# EasyEDA Pro project HACKERCARD.epro

# Schematic Schematic1
Board Name: Board1; Create Date: 2026-04-04; Page Name: P1; Project Name: pcb hacker card; Schematic Name: Schematic1; Update Date: 2026-04-05; Company: EasyEDA.com; Page Size: A4; Version: V1.0
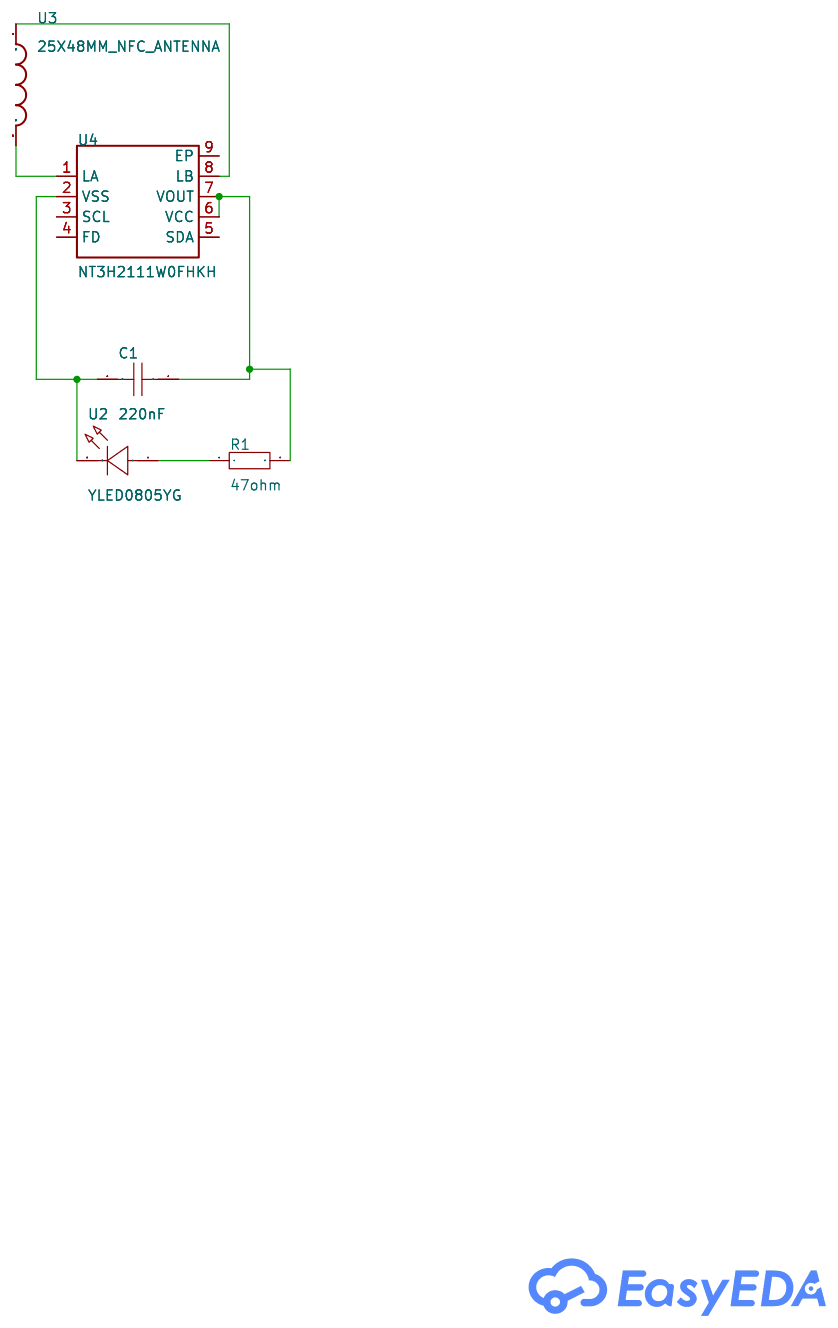
[diagram p0: schematic sheet]

## Parts
C1  220nF  [C0603]
R1  47ohm  [R0603]
U2  YLED0805YG  [LED0805-R-RD]
U3  25X48MM_NFC_ANTENNA  [25X48MM_NFC_ANTENNA]
U4  NT3H2111W0FHKH  [XQFN-8_L1.6-W1.6-P0.50-BL]

## Library data of the parts
C1 = CAP_0603: Supplier Footprint: 0603
R1 = Res_0603: Supplier Footprint: 0603
U2 = YLED0805YG: Lamp Holder Type:- Illumination Color:Yellow Green Voltage - Forward(Vf):1.8V~2.4V Voltage - Forward(Vf):1.8V~2.4V Power(Watts):- Forward Current:30mA Wavelength - Dominant:566nm~576nm Wavelength - Dominant:566nm~576nm Peak Wavelength:- Diode Configuratio; LCSC Part Name: 黄绿色 独立二极管; Supplier Part: C19171393; Manufacturer: YONGYUTAI(永裕泰); Supplier Footprint: 0805; JLCPCB Part Class: Extended Part; Datasheet: https://item.szlcsc.com/datasheet/YLED0805YG/20382444.html; Supplier: LCSC; Illumination Color: Yellow Green; Voltage - Forward(Vf): 1.8V~2.4V; Forward Current: 30mA; Wavelength - Dominant: 566nm~576nm; Diode Configuration: Discrete Diode; Luminous Intensity: 70mcd; Viewing Angle: 120°; Operating Temperature: -40℃~+85℃
U3 = 25X48MM_NFC_ANTENNA
U4 = NT3H2111W0FHKH: Supplier: LCSC; Supplier Part: C710403; Manufacturer: NXP(恩智浦); JLCPCB Part Class: Extended Part

## Nets
$1N359: U3.P$2 U4.1(LA)
$1N364: U3.P$1 U4.8(LB)
$1N689: C1.2 U2.2 U4.2(VSS)
$1N745: C1.1 R1.2 U4.6(VCC) U4.7(VOUT)
$1N815: R1.1 U2.1

Not connected (* = marked no-connect by the designer): U4 3(SCL) 4(FD) 5(SDA) 9(EP)

# Board PCB1
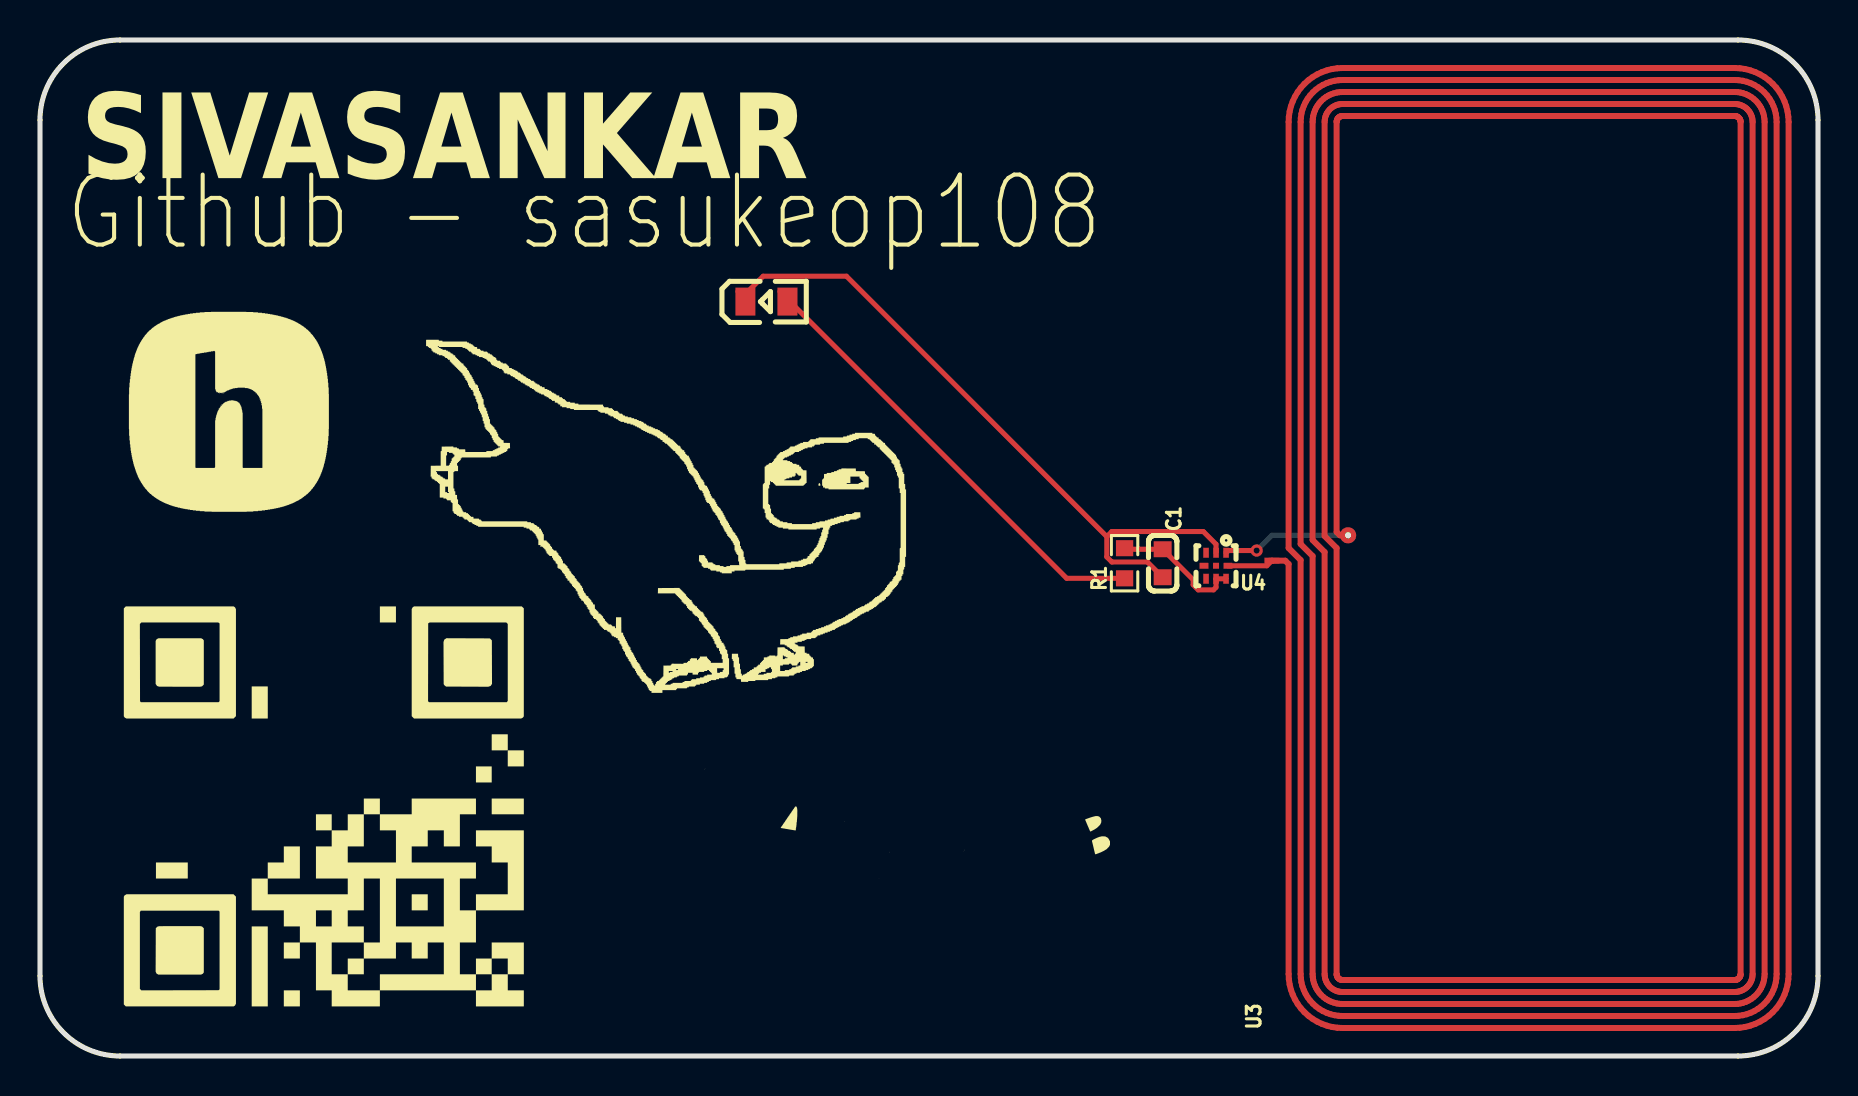
[diagram p1: board, top side]
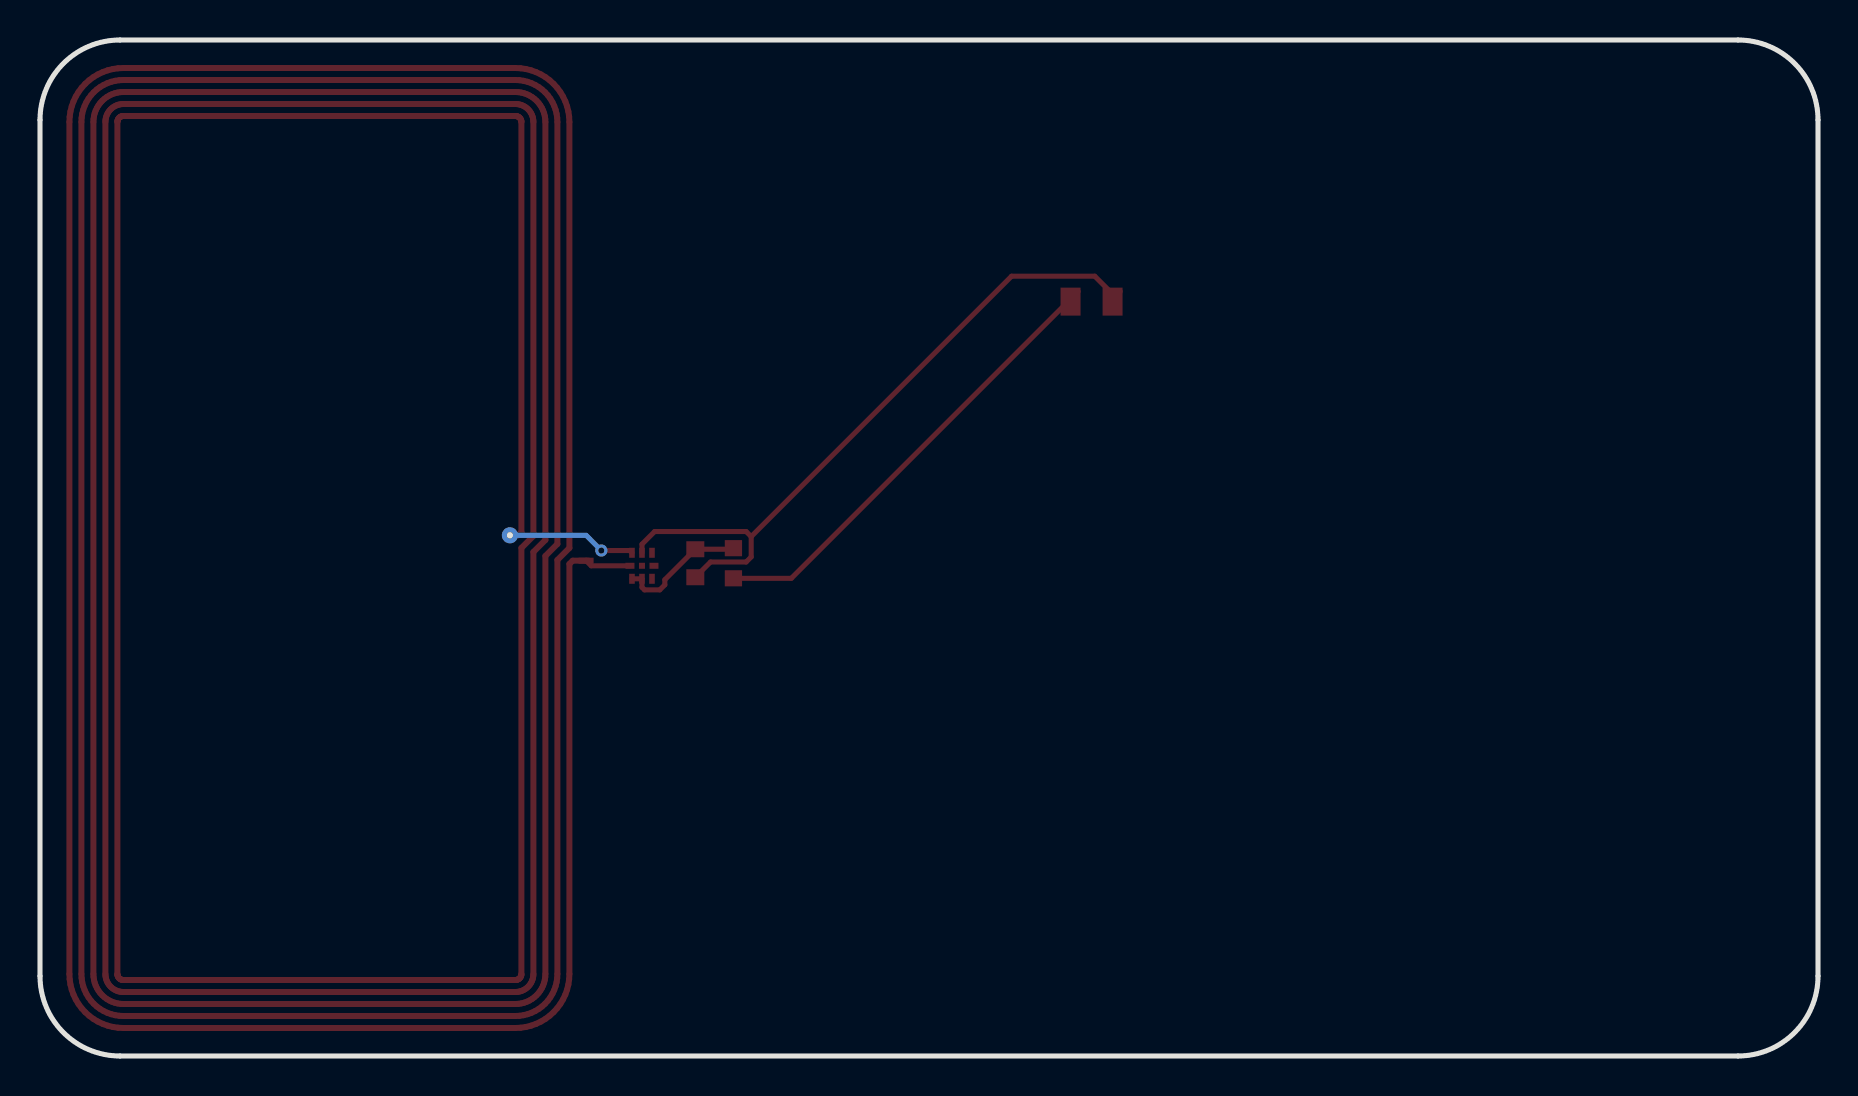
[diagram p2: board, bottom side, seen from below]

Outline 88.9 x 50.8 mm; copper layers: Top Layer, Bottom Layer. Coordinates in mm from the lower left corner of the outline.
Outline path: 0,46.8 0,4 arc(1.17,1.17) 4,0 84.9,0 arc(87.73,1.17) 88.9,4 88.9,46.8 arc(87.73,49.63) 84.9,50.8 4,50.8 arc(1.17,49.63) 0,46.8
Stack: Top Layer 0.035mm / Dielectric1 1.51mm FR4 er 4.5 / Bottom Layer 0.035mm

## Design rules (mm)
template: JLCPCB Capability(Two Layers Board)
spacing copperThickness1oz (default): track to track 0.102, other pairs 0.152 to 0.3
spacing copperThickness2oz: track to track 0.203, other pairs 0.152 to 0.3
track width copperThickness1oz (default): min 0.127, default 0.254, max 2.54
track width copperThickness2oz: min 0.203, default 0.254, max 2.54
differential pair differentialPair (default): width min 0.127, default 0.254, max 2.54; gap min 0.152, default 0.152
via viaSize (default): diameter min 0.5, default 0.61, max 10; hole min 0.3, default 0.305, max 6.3

## Placement (name value [footprint] x y rotation side)
C1  220nF  [C0603]  56.13 24.64 270 top
R1  47ohm  [R0603]  54.23 24.64 90 top
U2  YLED0805YG  [LED0805-R-RD]  36.32 37.72 0 top
U3  -  [25X48MM_NFC_ANTENNA]  74.93 25.4 90 top
U4  NT3H2111W0FHKH  [XQFN-8_L1.6-W1.6-P0.50-BL]  58.8 24.51 180 top

## Footprints (pads in the part's own frame, mm; a bottom-side part is the same pattern mirrored in y, then rotated)
25X48MM_NFC_ANTENNA
  rect 0.3x0.75 smd: P$1(-0.635,13.335)
  round 0.808 hole 0.3: P$2(0.635,9.525)
C0603
  rect 0.8x0.9 smd: 1(-0.7,0) 2(0.7,0)
LED0805-R-RD
  rect 1x1.399 smd: 1(1.05,0) 2(-1.05,0)
R0603
  rect 0.806x0.864 smd: 1(-0.753,0) 2(0.753,0)
XQFN-8_L1.6-W1.6-P0.50-BL
  rect 0.28x0.5 smd: 1(-0.5,-0.65) 2(0,-0.65) 3(0.5,-0.65) 5(0.5,0.65) 6(0,0.65) 7(-0.5,0.65)
  rect 0.45x0.3 smd: 4(0.6,0) 8(-0.6,0)
  rect 0.3x0.3 smd: 9(0,0)

## Nets
As in the schematic.

Pads without a net: U4 3 4 5 9

## Via types
v1: diameter 0.61, hole 0.305, Top Layer to Bottom Layer, 1 via

## Routing (per net, layer and track width the routed paths; a pad name or vN(x,y) marks a point on that pad's centre or on a via; arc(x,y) is an arc through that point)
$1N359: length 6.5
  Top Layer w0.254: v1(60.83,25.27) 59.41,25.27 U4.1
  Bottom Layer w0.254: U3.P$2 61.59,26.03 v1(60.83,25.27)
$1N364: length 2.3
  Top Layer w0.254: U3.P$1 61.34,24.51 59.4,24.51
$1N689: length 34.6
  Top Layer w0.254: 53.34,25.97 53.34,24.95 53.59,24.7 55.37,24.7 C1.2 ; 53.34,25.97 53.59,26.22 58.17,26.22 58.8,25.59 U4.2 ; 53.34,25.97 40.32,38.99 36.16,38.99 35.4,38.23 34.89,38.23
$1N745: length 6.6
  Top Layer w0.254: R1.2 54.28,25.34 C1.1 57.66,23.81 57.66,23.56 57.91,23.31 58.67,23.31 58.8,23.43 U4.6 U4.7
$1N815: length 23.2
  Top Layer w0.254: 36.99,38.23 51.33,23.88 R1.1

## Text on the board
Top Silkscreen Layer: Github - sasukeop108 | SIVASANKAR
